# Altium schematic sheet Power Management.SchDoc: Power Management
size 287 x 198 mm; DocumentNumber: 1; Revision: 1.0; SheetNumber: 2; SheetTotal: 4
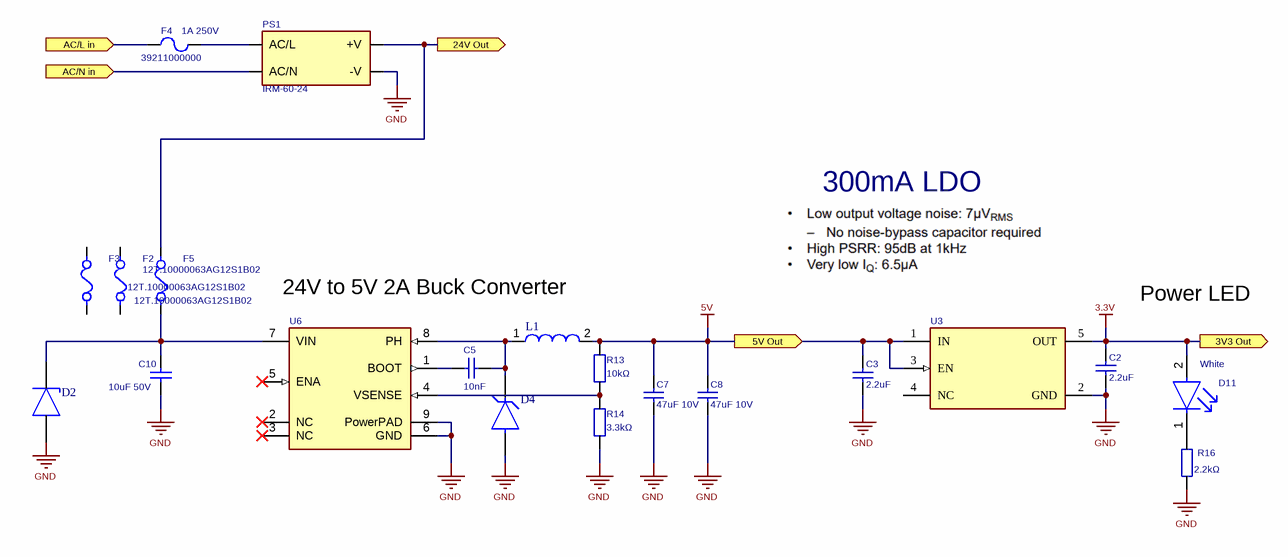
[diagram p0: Power Management.SchDoc]

## Parts
C2  value 2.2uF  [CAPC1005X05N]
C3  value 2.2uF  [CAPC1005X05N]
C5  value 10nF  [CAPC1005X05N]
C7  value 47uF 10V  [CAPC3216X16N]
C8  value 47uF 10V  [CAPC3216X16N]
C10  value 10uF 50V  [CAPC3216X16N]
D2  (no value)  [SOD-123FL]
D4  (no value)  [SOD-123]
D11  value White  [LEDC1608X08N]
F2  MPN: 12T.10000063AG12S1B02  [FP-SF-1206S-IPC_B]
F3  MPN: 12T.10000063AG12S1B02  [FP-SF-1206S-IPC_B]
F4  value 1A 250V  MPN: 39211000000  [FUS_LITTELFUSE_392_LTF]
F5  MPN: 12T.10000063AG12S1B02  [FP-SF-1206S-IPC_B]
L1  (no value)  [SWPA6054A]
PS1  (no value)  [IRM-60-24]
R13  value 10kΩ  [RESC1005X04N]
R14  value 3.3kΩ  [RESC1005X04N]
R16  value 2.2kΩ  [RESC1005X04N]
U3  (no value)  [FP-DBV0005A-MFG]
U6  (no value)  [FP-DDA0008J-MFG]

## Ports
3V3 Out (out), 5V Out (out), 24V Out (out), AC/L in (in), AC/N in (in)

## Nets
3.3V: C2.2 D11.2(A) U3.5(OUT) ; port 3V3 Out
5V: C3.2 C7.1 C8.1 L1.2 R13.1 U3.1(IN) U3.3(EN) ; port 5V Out
GND: C2.1 C3.1 C7.2 C8.2 C10.1 D2.1(A) D4.A PS1.-V R14.2 R16.2 U3.2(GND) U6.6(GND) U6.9(PowerPAD)
24V Out: F5.2 PS1.+V ; port 24V Out
AC/L in: F4.1 ; port AC/L in
AC/N in: PS1.AC/N ; port AC/N in
NetC5_1: C5.1 U6.1(BOOT)
NetC5_2: C5.2 D4.K(C) L1.1 U6.8(PH)
NetC10_2: C10.2 D2.2(C) F5.1 U6.7(VIN)
NetD11_1: D11.1(C) R16.1
NetF4_2: F4.2 PS1.AC/L
NetR13_2: R13.2 R14.1 U6.4(VSENSE)

Not connected (* = marked no-connect by the designer): F2 1 2; F3 1 2; U3 4(NC); U6 2(NC)* 3(NC)* 5(ENA)*

## Notes on the sheet
- 300mA LDO
- 24V to 5V 2A Buck Converter
- Power LED
- Redako
- Keilestraat 5a, 3029BP, Rotterdam, M: david@redako.nl, T: +31 6 16001008
- Project
- Title
- Customer
- Size:
- Date:
- File:
- A4
- Revision:
- Time:
- Drawn by:
- GIT Revision:
- Sheet:
- of

## Library data of the parts
C2 C3 C5 = SMD_Cap: Package: 0402
C7 C8 = SMD_Cap: Rating: 10V; Package: 1206
C10 = CMP-2000-06048-1: Rating: 50V; Package: 1206
D2 = d386f69c7d770905792c16b93fa31a7: SMF24A-E3-08 Trans Voltage Suppressor Diode, 1000W, 24V V(RWM), Unidirectional, 1 Element, Silicon, DO-219AB; MPN: SMF24A
D4 = f813f71cba58e380607f5dd3caf9714: BZT52C20-7-F BZT52C20 Series 20 V 10 mA 500 mW Surface Mount Zener Diode - SOD-123; MPN: B5819W SL; Package: SOD-123; JLCPCB Part #: C8598
D11 = CMP-22017-000005-1: LED; Package: 0603
F2 F3 F5 = CMP-07399-000003-1: FUSE BOARD MOUNT 1A 63VDC 1206; Package: 1206
F4 = FUSE-2: Manufacturer: Littelfuse; JLC Part Type: Extended; JLCPCB Part #: C99566
L1 = SWPA6045S101MT: 100uH ±20% 800mA 433mΩ SMD,6.0x6.0x4.5mm Power Inductors RoHS; MPN: SWPA6045S101MT; Package: SMD,6.0x6.0x4.5mm; JLC Part Type: Extended; JLCPCB Part #: C60633
PS1 = IRM-60-24: Enclosed AC DC Converters 1 Uitgang 24V 2.5A 85 ~ 264 VAC Input; Package: DIP-4 Mean Well; Value: 24V; MPN: IRM-60-24
R13 R14 R16 = Res: Package: 0402
U3 = CMP-04917-000300-1: IC REG LINEAR 3.3V 300MA SOT23-5; MPN: TPS7A2033PDBVR
U6 = CMP-2000-04960-2: IC REG BUCK ADJUSTABLE 3A 8SOPWR; Manufacturer: Texas Instruments; MPN: TPS5430DDAR; Package: LSOP-8; JLCPCB Part #: C9864